# EAGLE design AVRKit_TFT (EAGLE 7.6.0)

## Sheet 1 of 3
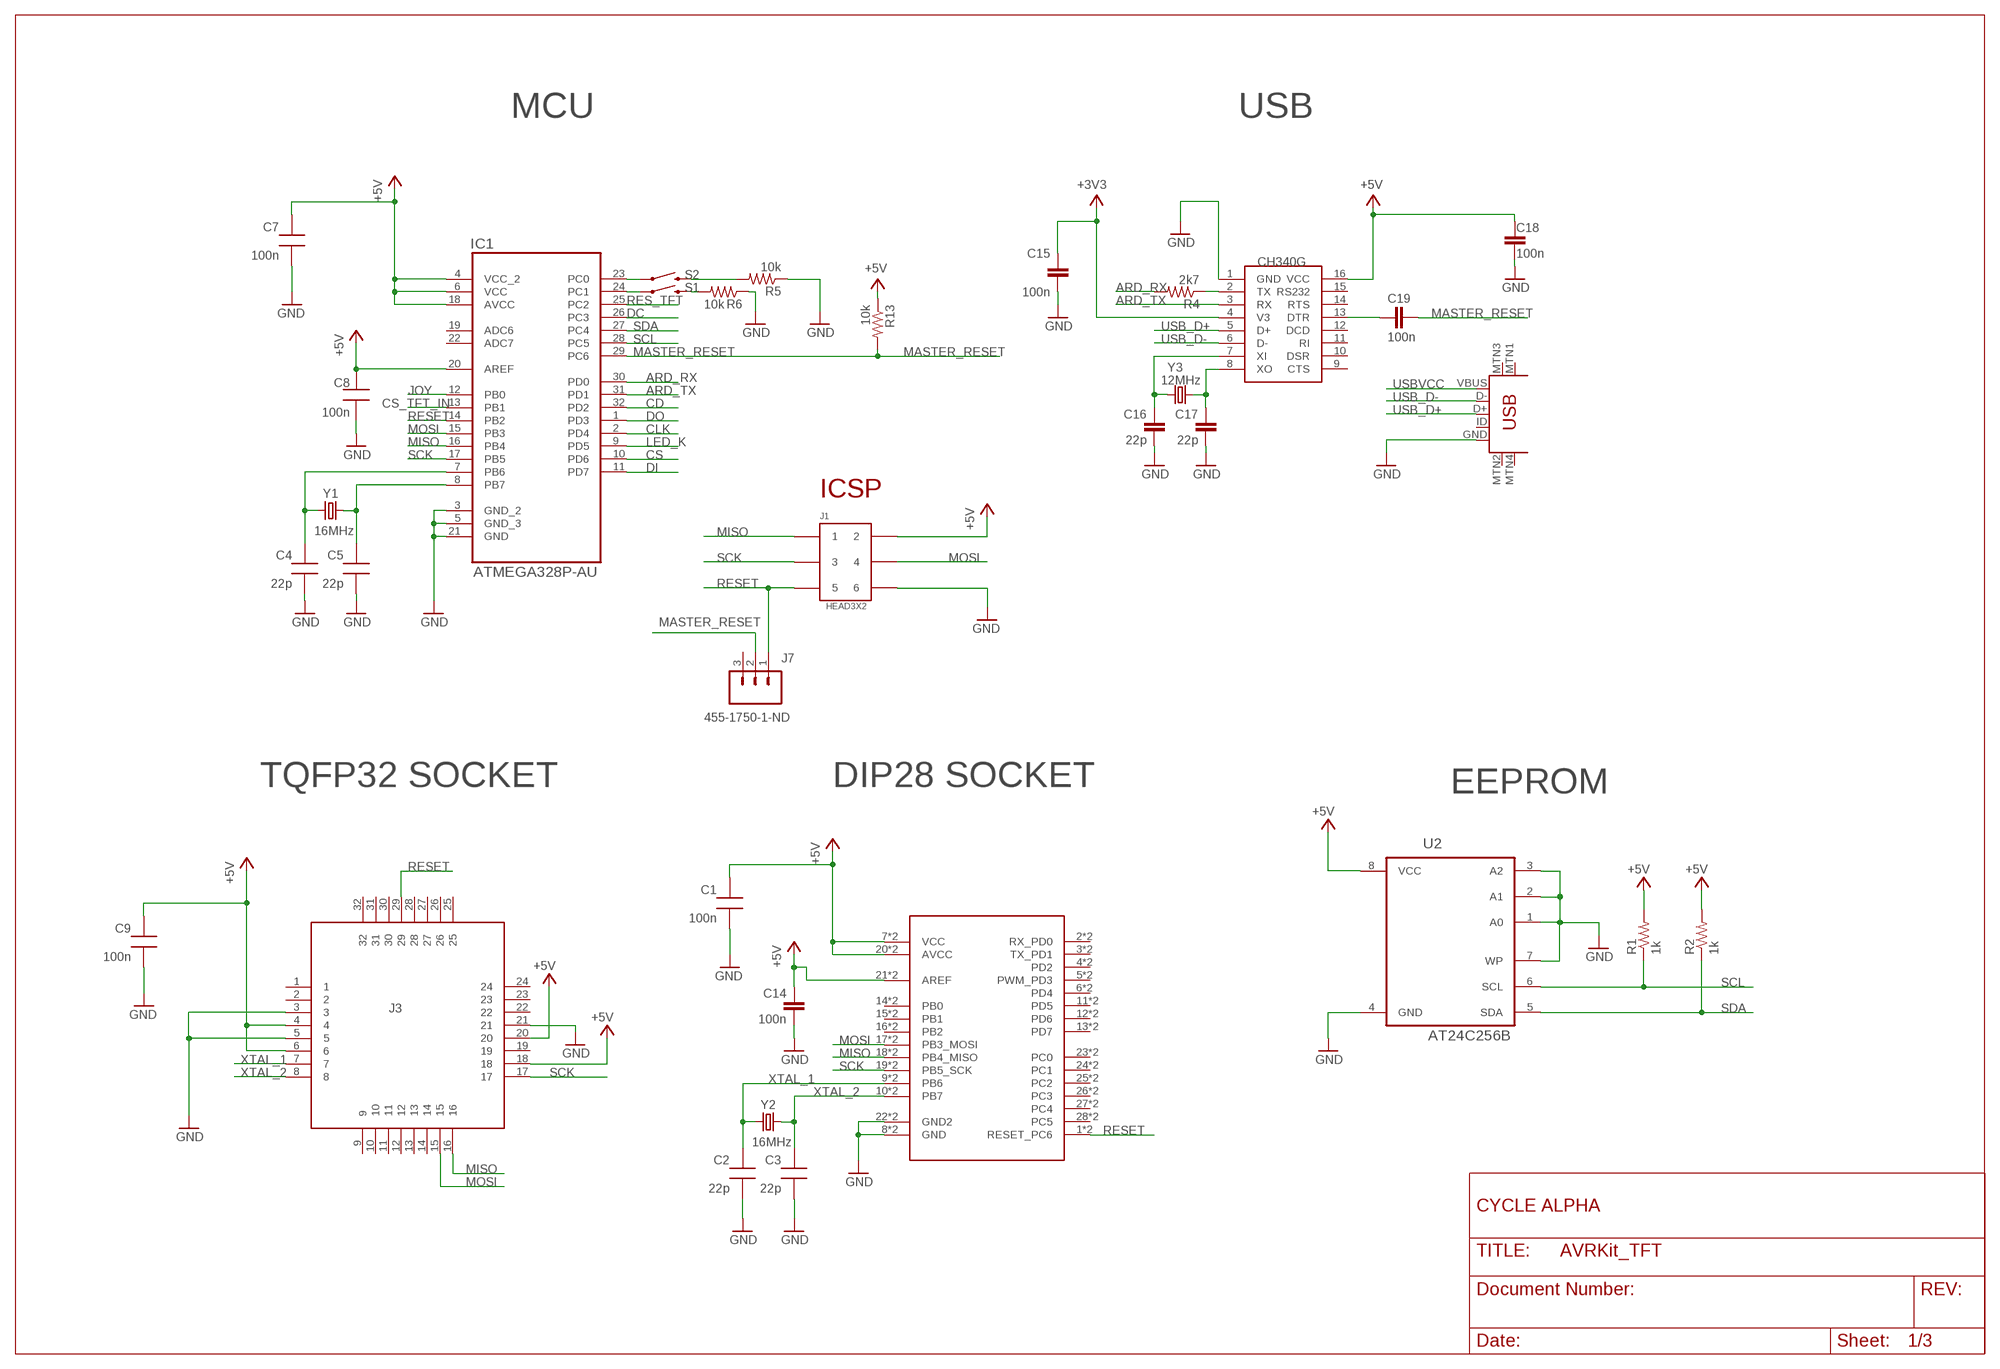
[diagram p0: schematic, sheet 1]

### Parts
C1  100n  CAP0805-NP  [CAP0805-NP]
C2  22p  CAP0805-NP  [CAP0805-NP]
C3  22p  CAP0805-NP  [CAP0805-NP]
C4  22p  CAP0805-NP  [CAP0805-NP]
C5  22p  CAP0805-NP  [CAP0805-NP]
C7  100n  CAP0805-NP  [CAP0805-NP]
C8  100n  CAP0805-NP  [CAP0805-NP]
C9  100n  CAP0805-NP  [CAP0805-NP]
C14  100n  22UF-6.3V-20%(0805)  [0805]
C15  100n  22UF-6.3V-20%(0805)  [0805]
C16  22p  22UF-6.3V-20%(0805)  [0805]
C17  22p  22UF-6.3V-20%(0805)  [0805]
C18  100n  22UF-6.3V-20%(0805)  [0805]
C19  100n  22UF-6.3V-20%(0805)  [0805]
IC1  ATMEGA328P-AU  [QFP80P900X900X120-32N]
J1  HEAD3X2  [HEAD3X2]
J3  TQFP32_ADAPTER  [TQFP32_ADAPTER]
J4  _ZIF28ADAPTER_2ROWS  [DIL28_2ROWS]
J5  USB-MINIB-5PIN  [USB-MINIB]
J7  455-1750-1-ND  CONN_03  [1X03]
R1  1k  R-US_R0805  [R0805@1]
R2  1k  R-US_R0805  [R0805@1]
R4  2k7  R-US_R0805  [R0805@1]
R5  10k  R-US_R0805  [R0805@1]
R6  10k  R-US_R0805  [R0805@1]
R13  10k  R-US_R0805  [R0805@1]
S1  SWITCH-MOMENTARY-2SMD-4  [TACTILE_SWITCH_TALL]
S2  SWITCH-MOMENTARY-2SMD-4  [TACTILE_SWITCH_TALL]
U1  0  CH340G  [SOIC16]
U2  AT24C256B  [SOIC8]
Y1  16MHz  CRYSTAL5X3  [CRYSTAL-SMD-5X3]
Y2  16MHz  CRYSTAL5X3  [CRYSTAL-SMD-5X3]
Y3  12MHz  CRYSTALCRYSTAL-SMD-5X3-16MHZ  [CRYSTAL-SMD-5X3]

### Nets
+3V3: C15.2 U1.4(V3) ; also sheet 2,3
+5V: C1.1 C7.1 C8.1 C9.1 C14.1 C18.2 IC1.4(VCC_2) IC1.6(VCC) IC1.18(AVCC) IC1.20(AREF) J1.2 J3.4 J3.6 J3.18 J3.20 J4.7(VCC) J4.20(AVCC) J4.21(AREF) J4.107(VCC) J4.120(AVCC) J4.121(AREF) R1.2 R2.2 R13.1 U1.16(VCC) U2.8(VCC) ; also sheet 2,3
ARD_RX: IC1.30(PD0) R4.2
ARD_TX: IC1.31(PD1) U1.3(RX)
CD: IC1.32(PD2) ; also sheet 2
CLK: IC1.2(PD4) ; also sheet 2
CS: IC1.10(PD6) ; also sheet 2
CS_TFT_IN: IC1.13(PB1) ; also sheet 3
DC: IC1.26(PC3) ; also sheet 3
DI: IC1.11(PD7) ; also sheet 2
DO: IC1.1(PD3) ; also sheet 2
GND: C1.2 C2.2 C3.2 C4.2 C5.2 C7.2 C8.2 C9.2 C14.2 C15.1 C16.2 C17.2 C18.1 IC1.3(GND_2) IC1.5(GND_3) IC1.21(GND) J1.6 J3.3 J3.5 J3.21 J4.8(GND) J4.22(GND2) J4.108(GND) J4.122(GND2) J5.GND R5.1 R6.1 U1.1(GND) U2.1(A0) U2.2(A1) U2.3(A2) U2.4(GND) U2.7(WP) ; also sheet 2,3
JOY: IC1.12(PB0) ; also sheet 3
LED_K: IC1.9(PD5) ; also sheet 3
MASTER_RESET: C19.1 IC1.29(PC6) J7.2 R13.2
MISO: IC1.16(PB4) J1.1 J3.16 J4.18(PB4_MISO) J4.118(PB4_MISO)
MOSI: IC1.15(PB3) J1.4 J3.15 J4.17(PB3_MOSI) J4.117(PB3_MOSI) ; also sheet 3
N$6: IC1.23(PC0) S2.A2
N$7: IC1.24(PC1) S1.A2
N$8: R5.2 S2.B2
N$9: R6.2 S1.B2
N$14: C19.2 U1.13(DTR)
N$17: R4.1 U1.2(TX)
OSC3: C4.1 IC1.7(PB6) Y1.3
OSC4: C5.1 IC1.8(PB7) Y1.1
RES_TFT: IC1.25(PC2) ; also sheet 3
RESET: IC1.14(PB2) J1.5 J3.29 J4.1(RESET_PC6) J4.101(RESET_PC6) J7.1
SCK: IC1.17(PB5) J1.3 J3.17 J4.19(PB5_SCK) J4.119(PB5_SCK) ; also sheet 3
SCL: IC1.28(PC5) R1.1 U2.6(SCL)
SDA: IC1.27(PC4) R2.1 U2.5(SDA)
USB_D+: J5.D+ U1.5(D+)
USB_D-: J5.D- U1.6(D-)
USBVCC: J5.VBUS ; also sheet 2
XI1: C16.1 U1.7(XI) Y3.1
XO1: C17.1 U1.8(XO) Y3.3
XTAL_1: C2.1 J3.7 J4.9(PB6) J4.109(PB6) Y2.3
XTAL_2: C3.1 J3.8 J4.10(PB7) J4.110(PB7) Y2.1
Unconnected: IC1.19(ADC6) IC1.22(ADC7) J3.1 J3.2 J3.9 J3.10 J3.11 J3.12 J3.13 J3.14 J3.19 J3.22 J3.23 J3.24 J3.25 J3.26 J3.27 J3.28 J3.30 J3.31 J3.32 J4.2(RX_PD0) J4.3(TX_PD1) J4.4(PD2) J4.5(PWM_PD3) J4.6(PD4) J4.11(PD5) J4.12(PD6) J4.13(PD7) J4.14(PB0) J4.15(PB1) J4.16(PB2) J4.23(PC0) J4.24(PC1) J4.25(PC2) J4.26(PC3) J4.27(PC4) J4.28(PC5) J4.102(RX_PD0) J4.103(TX_PD1) J4.104(PD2) J4.105(PWM_PD3) J4.106(PD4) J4.111(PD5) J4.112(PD6) J4.113(PD7) J4.114(PB0) J4.115(PB1) J4.116(PB2) J4.123(PC0) J4.124(PC1) J4.125(PC2) J4.126(PC3) J4.127(PC4) J4.128(PC5) J5.ID J5.MTN1(MTN2) J5.MTN2(MTN3) J5.MTN3(MTN1) J5.MTN4 J7.3 U1.9(CTS) U1.10(DSR) U1.11(RI) U1.12(DCD) U1.14(RTS) U1.15(RS232)

### Notes on the sheet
- MCU | USB
- ICSP
- TQFP32 SOCKET | DIP28 SOCKET | EEPROM
- CYCLE ALPHA

## Sheet 2 of 3
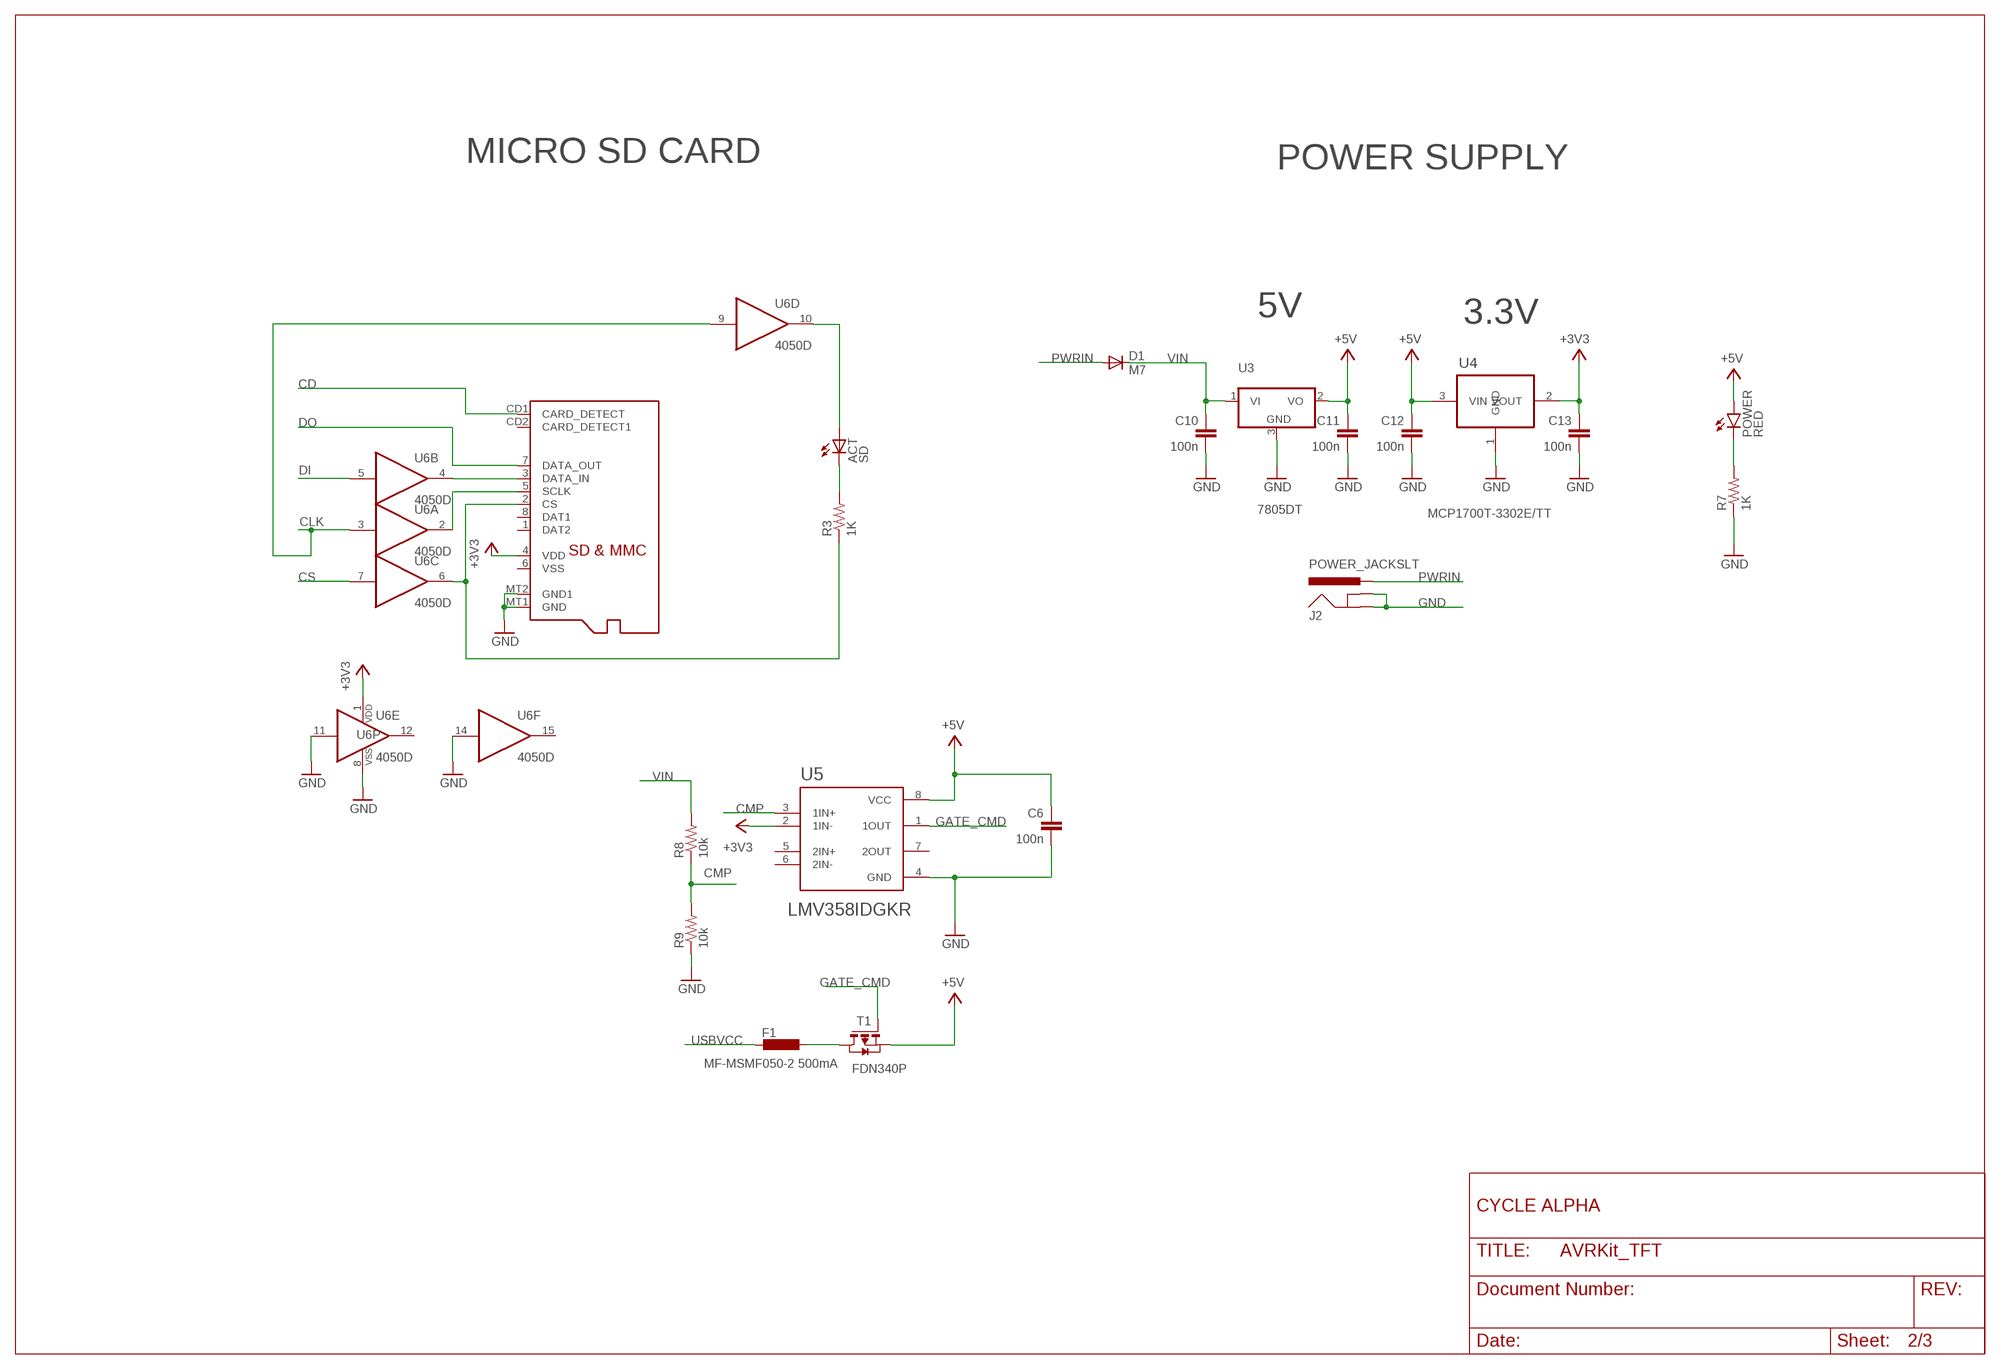
[diagram p1: schematic, sheet 2]

### Parts
ACT  SD  LEDCHIP-LED0805  [CHIP-LED0805]
C6  100n  22UF-6.3V-20%(0805)  [0805]
C10  100n  22UF-6.3V-20%(0805)  [0805]
C11  100n  22UF-6.3V-20%(0805)  [0805]
C12  100n  22UF-6.3V-20%(0805)  [0805]
C13  100n  22UF-6.3V-20%(0805)  [0805]
D1  M7  DIODE-SMB  [SMB]
F1  MF-MSMF050-2 500mA  L-EUL1812  [L1812]
J2  POWER_JACKSLT  [POWER_JACK_SLOT]
J6  MICROSD_FOOTPRINT_2  [MICROSD_FOOTPRINT_2]
POWER  RED  LED-RED1206  [LED-1206]
R3  1K  R-US_R0805  [R0805]
R7  1K  R-US_R0805  [R0805]
R8  10k  R-US_R0805  [R0805]
R9  10k  R-US_R0805  [R0805]
T1  FDN340P  PMOSSOT23  [SOT-23]
U3  7805DT  [TO252]
U4  MCP1700T-3302E/TT  [SOT95P237X112-3N]
U5  LMV358IDGKR  [SOP65P490X110-8N]
U6  4050D  [SO16]

### Nets
+3V3: C13.1 J6.4(VDD) U4.2(VOUT) U5.2(1IN-) U6.1(P:VDD) ; also sheet 1,3
+5V: C6.1 C11.1 C12.1 POWER.A T1.2(S) U3.2(VO) U4.3(VIN) U5.8(VCC) ; also sheet 1,3
CD: J6.CD1(CARD_DETECT) ; also sheet 1
CLK: U6.3(A:I) U6.9(D:I) ; also sheet 1
CMP: R8.1 R9.2 U5.3(1IN+)
CS: U6.7(C:I) ; also sheet 1
DI: U6.5(B:I) ; also sheet 1
DO: J6.7(DATA_OUT) ; also sheet 1
GATE_CMD: T1.3(G) U5.1(1OUT)
GND: C6.2 C10.2 C11.2 C12.2 C13.2 J2.GND@1(GNDBREAK) J2.GND@2(GND) J6.MT1(GND) J6.MT2(GND1) R7.1 R9.1 U3.3(GND) U4.1(GND) U5.4(GND) U6.8(P:VSS) U6.11(E:I) U6.14(F:I) ; also sheet 1,3
N$1: ACT.A U6.10(D:O)
N$2: J6.5(SCLK) U6.2(A:O)
N$3: J6.2(CS) R3.1 U6.6(C:O)
N$4: ACT.C R3.2
N$5: J6.3(DATA_IN) U6.4(B:O)
N$10: POWER.C R7.2
N$15: F1.1 T1.1(D)
PWRIN: D1.A J2.PWR
USBVCC: F1.2 ; also sheet 1
VIN: C10.1 D1.C R8.2 U3.1(VI)
Unconnected: J6.1(DAT2) J6.6(VSS) J6.8(DAT1) J6.CD2(CARD_DETECT1) U5.5(2IN+) U5.6(2IN-) U5.7(2OUT) U6.12(E:O) U6.15(F:O)

### Notes on the sheet
- MICRO SD CARD | POWER SUPPLY
- 5V | 3.3V
- CYCLE ALPHA

## Sheet 3 of 3
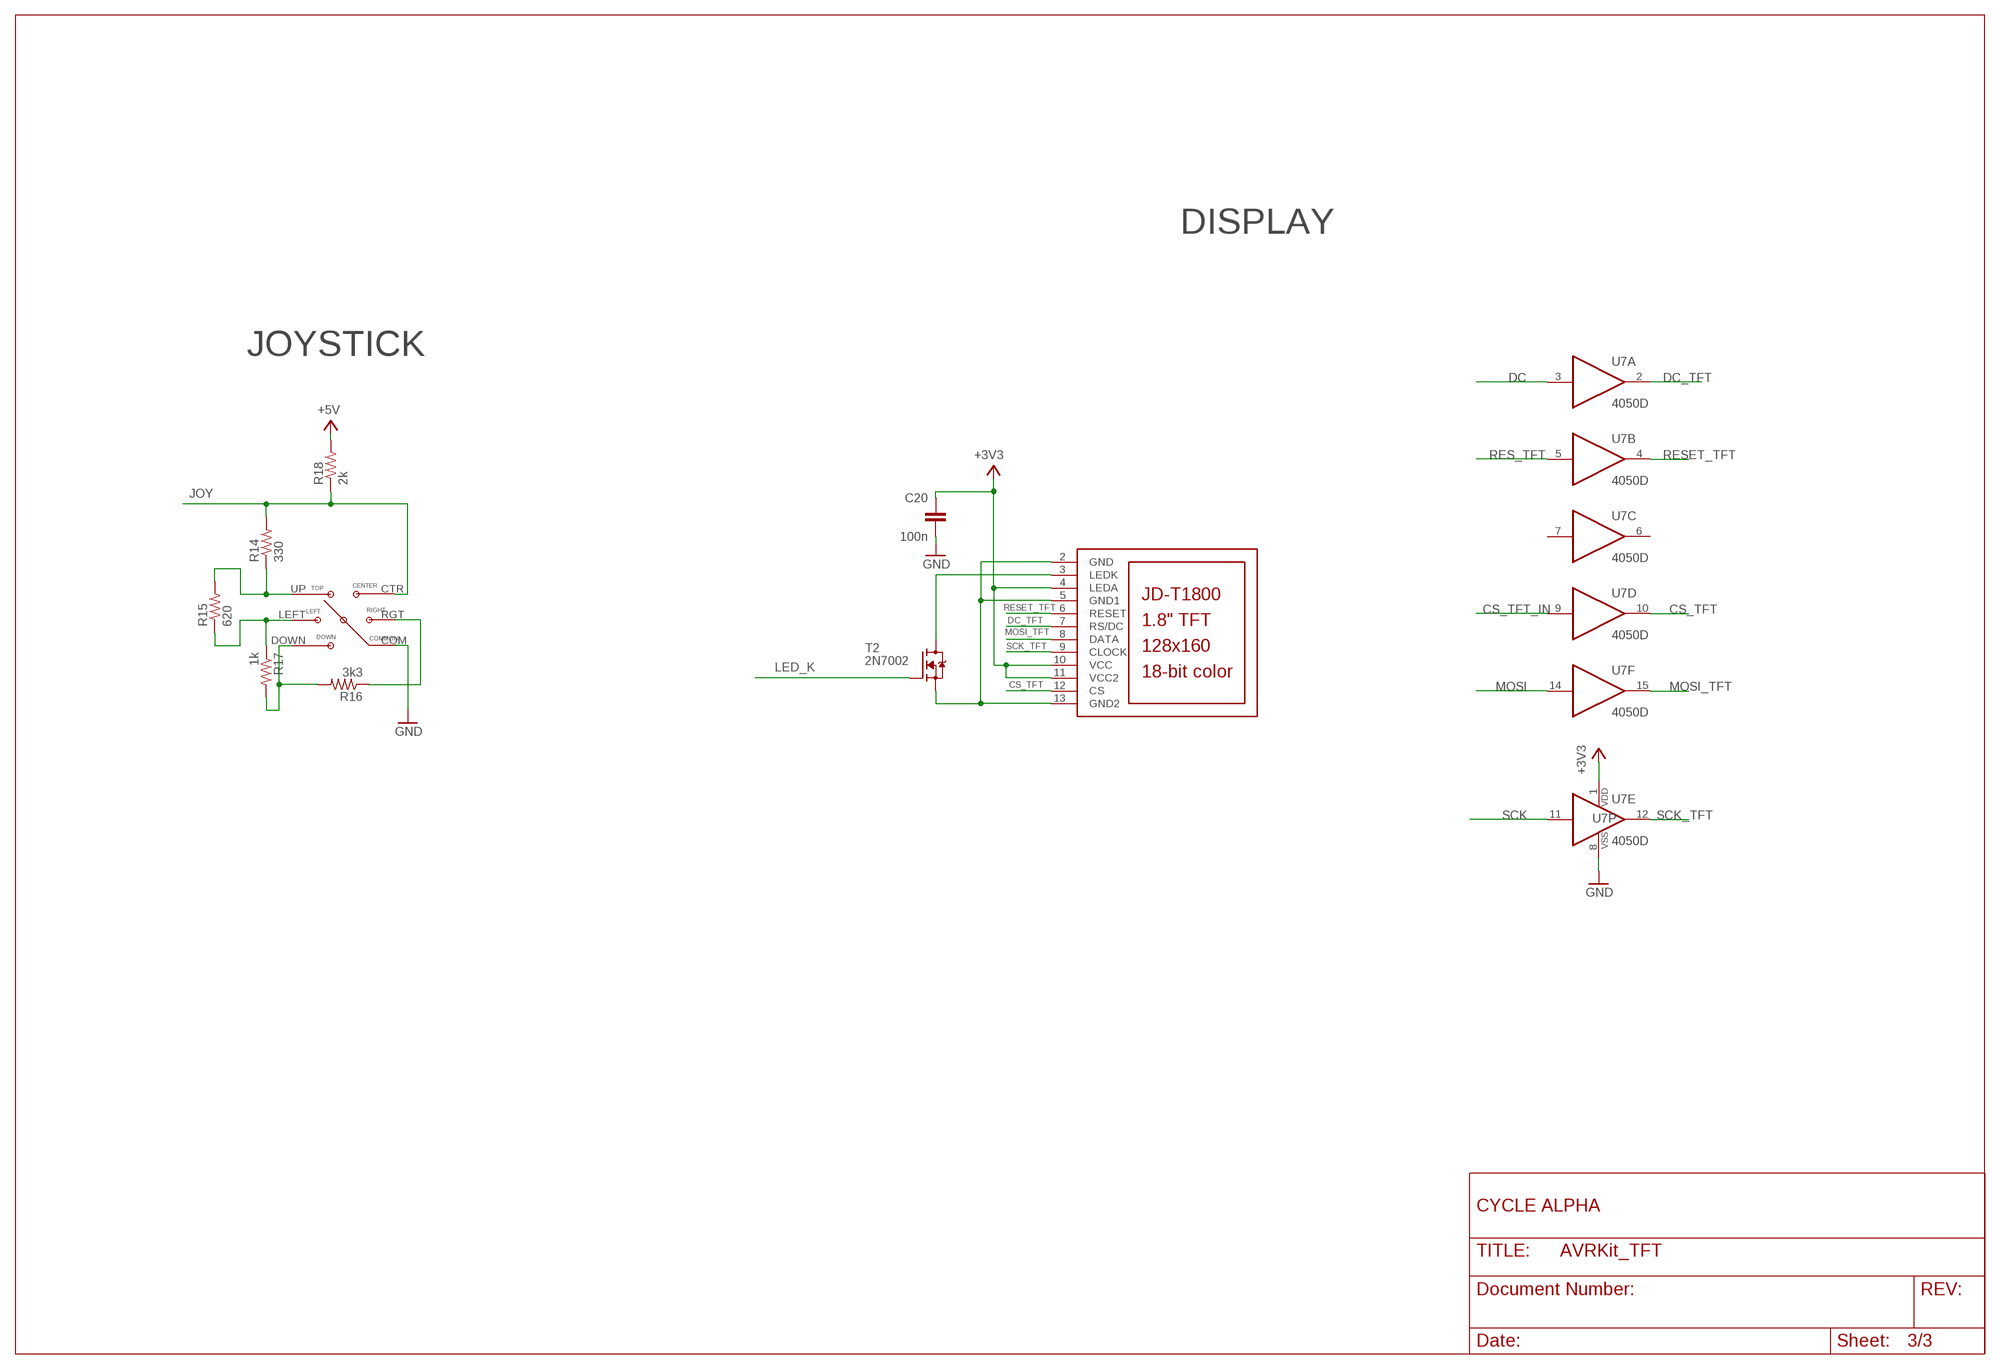
[diagram p2: schematic, sheet 3]

### Parts
C20  100n  22UF-6.3V-20%(0805)  [0805]
LCD1  JD-T1800  [JD-T1800]
R14  330  R-US_R0805  [R0805]
R15  620  R-US_R0805  [R0805]
R16  3k3  R-US_R0805  [R0805]
R17  1k  R-US_R0805  [R0805]
R18  2k  R-US_R0805  [R0805]
T2  2N7002  [SOT23]
U7  4050D  [SO16]
U$3  JOG-SWITCH-5-WAY-SMD  [JOG-SWITCH-10MM-SMD]

### Nets
+3V3: C20.2 LCD1.4(LEDA) LCD1.10(VCC) LCD1.11(VCC2) U7.1(P:VDD) ; also sheet 1,2
+5V: R18.2 ; also sheet 1,2
CS_TFT: LCD1.12(CS) U7.10(D:O)
CS_TFT_IN: U7.9(D:I) ; also sheet 1
DC: U7.3(A:I) ; also sheet 1
DC_TFT: LCD1.7(RS/DC) U7.2(A:O)
GND: C20.1 LCD1.2(GND) LCD1.5(GND1) LCD1.13(GND2) T2.2(S) U7.8(P:VSS) U$3.COM ; also sheet 1,2
JOY: R14.2 R18.1 U$3.CTR ; also sheet 1
LED_K: T2.1(G) ; also sheet 1
MOSI: U7.14(F:I) ; also sheet 1
MOSI_TFT: LCD1.8(DATA) U7.15(F:O)
N$18: LCD1.3(LEDK) T2.3(D)
N$20: R14.1 R15.2 U$3.UP
N$21: R15.1 R17.1 U$3.LEFT
N$22: R16.2 R17.2 U$3.DOWN
N$23: R16.1 U$3.RGT
RES_TFT: U7.5(B:I) ; also sheet 1
RESET_TFT: LCD1.6(RESET) U7.4(B:O)
SCK: U7.11(E:I) ; also sheet 1
SCK_TFT: LCD1.9(CLOCK) U7.12(E:O)
Unconnected: U7.6(C:O) U7.7(C:I)

### Notes on the sheet
- DISPLAY
- JOYSTICK
- CYCLE ALPHA

## Library data of the parts
ACT = adafruit:LED: LED OSRAM: - CHIPLED LG R971, LG N971, LY N971, LG Q971, LY Q971, LO R971, LY R971 LH N974, LH R974 LS Q976, LO Q976, LY Q976 LO Q996 - Hyper CHIPLED LW Q18S LB Q993, LB Q99A, LB R99A - SideLED LS A670, LO A670, LY A670, LG A670, LP A670 LB A673, LV A673, LT A673, LW A673 LH A674 LY A675 LS A676, LA A676, LO A676, LY A676, LW A676 LS A679, LY A679, LG A679 - Hyper Micro SIDELED® LS Y876, LA Y876, LO Y876, LY Y876 LT Y87S - SmartLED LW L88C, LW L88S LB L89C, LB L89S, LG L890 LS L89K, LO L89K, LY L89K LS L896, LA L896, LO L896, LY L896 - TOPLED LS T670, LO T670, LY T670, LG T670, LP T670 LSG T670, LSP T670, LSY T670, LOP T670, LYG T670 LG T671, LOG T671, LSG T671 LB T673, LV T673, LT T673, LW T673 LH T674 LS T676, LA T676, LO T676, LY T676, LB T676, LH T676, LSB T676, LW T676 LB T67C, LV T67C, LT T67C, LS T67K, LO T67K, LY T67K, LW E67C LS E67B, LA E67B, LO E67B, LY E67B, LB E67C, LV E67C, LT E67C LW T67C LS T679, LY T679, LG T679 LS T770, LO T770, LY T770, LG T770, LP T770 LB T773, LV T773, LT T773, LW T773 LH T774 LS E675, LA E675, LY E675, LS T675 LS T776, LA T776, LO T776, LY T776, LB T776 LHGB T686 LT T68C, LB T68C - Hyper Mini TOPLED® LB M676 - Mini TOPLED Santana® LG M470 LS M47K, LO M47K, LY M47K Source: http://www.osram.convergy.de/
C1-C5 C7-C9 = MySMD:CAP0805-NP
C6 C10-C20 = SparkFun-Capacitors:22UF-6.3V-20%(0805): CAP-08402 Ceramic; PROD_ID: CAP-08402; VALUE: 22uF
D1 = diode:DIODE-: DIODE
F1 = rcl:L-EU: INDUCTOR, European symbol
IC1 = Atmel_By_element14_Batch_1-00:ATMEGA328P-AU: 8-bit Microcontroller with In-System Programmable Flash; MPN: ATMEGA328P-AU; OC_FARNELL: 1715486; OC_NEWARK: 14R4631; PACKAGE: TQFP-32; SUPPLIER: Atmel
J1 = MyCON2:HEAD3X2
J2 = SparkFun-Connectors:POWER_JACK: Power Jack This is the standard 5.5mm barrel jack for power. The PTH is the most common, proven, reliable, footprint. The Slot footprint only works if the mill layer is transmitted to the PCB fab house so be warned. Mating wall wart : TOL-00298 (and others); PROD_ID: PRT-00119
J3 = TQFP32_ADAPTER:TQFP32_ADAPTER
J4 = DIP28_ADAPTER_ATMEGA328P-PU:_ZIF28ADAPTER_2ROWS
J5 = SparkFun:USB-MINIB: Mini-USB "B" connector with 5th pin broken out. Created new symbol breaking out 5th "ID" pin in mini/micro USB connector spec. See: http://en.wikipedia.org/wiki/Mini_usb#Cables. Uses same footprint as 4-pin symbol. Also added pins to connect to mounting / shield pads if required (probably not generally needed as signals aren't shielded once they leave the connector).
J6 = adafruit:MICROSD_FOOTPRINT_2: Micro-SD / Transflash card holder with SPI pinout For the 3M # 2908-05WB-MG and/or 4UCON #19656 push-push type
J7 = SparkFun-Connectors:CONN_03: Multi connection point. Often used as Generic Header-pin footprint for 0.1 inch spaced/style header connections On any of the 0.1 inch spaced packages, you can populate with these: Break Away Headers - Straight <https://www.sparkfun.com/products/116> (PRT-00116) Break Away Male Headers - Right Angle <https://www.sparkfun.com/products/553> (PRT-00553) Female Headers <https://www.sparkfun.com/products/115> (PRT-00115) Break Away Headers - Machine Pin <https://www.sparkfun.com/products/117> (PRT-00117) Break Away Female Headers - Swiss Machine Pin <https://www.sparkfun.com/products/743> (PRT-00743) Stackable Header - 3 Pin (Female, 0.1") <https://www.sparkfun.com/products/13875> (PRT-13875) For SCREWTERMINALS and SPRING TERMINALS visit here: Screw Terimnals on SparkFun.com <https://www.sparkfun.com/search/results?term=Screw+Terminals> (5mm/3.5mm/2.54mm spacing) This device is also useful as a general connection point to wire up your design to another part of your project. Our various solder wires solder well into these plated through hole pads. Hook-Up Wire - Assortment (Stranded, 22 AWG) <https://www.sparkfun.com/products/11375> (PRT-11375) Hook-Up Wire - Assortment (Solid Core, 22 AWG) <https://www.sparkfun.com/products/11367> (PRT-11367) View the entire wire category on our website here <https://www.sparkfun.com/categories/141> Special notes: Molex polarized connector foot print use with SKU : PRT-08232 with associated crimp pins and housings.; PROD_ID: XXX-00000
LCD1 = adafruit:JD-T1800
POWER = SparkFun-LED:LED-RED: Assorted Red LEDs LilyPad 1206- DIO-09912 1206- DIO-00809 0603- DIO-00819 "SMART" means more efficient and expensive; PROD_ID: DIO-09912
R1 R2 R4-R6 R13 = resistor:R-US_: RESISTOR, American symbol
R3 R7-R9 R14-R18 = adafruit:R-US_: RESISTOR, American symbol
S1 S2 = SparkFun-Electromechanical:SWITCH-MOMENTARY-2: Various NO switches- pushbuttons, reed, etc; PROD_ID: SWCH-11966
T1 = zetex:PMOSSOT23: MOS FET
T2 = 00HT:2N7002: 2N7002 N Channel Mosfet in SOT23
U1 = ch340g:CH340G
U2 = AT24C256B (EEPROM) _duzi padovi:AT24C256B: Switch Mode Regulator; AVAILABILITY: Good; DESCRIPTION: IC REG MULT CONFIG ISO ADJ 8SOIC; MF: Texas Instruments; MP: LM5002MA; PACKAGE: SOIC-8 Texas Instruments; PRICE: 2.90 USD
U3 = linear:78*: Positive VOLTAGE REGULATOR Source: http://cache.national.com/ds/LM/LM78L05.pdf http://www.fairchildsemi.com/ds/LM/LM7805.pdf
U4 = MCP1700T-3302E_TT:MCP1700T-3302E/TT: Low Quiescent Current LDO
U5 = LMV358IDGKR:LMV358IDGKR: Dual Low-Voltage Rail-to-Rail Output Operational Amplifier 8-VSSOP -40 to 125; AVAILABILITY: Good; DESCRIPTION: IC OPAMP GP 1MHZ RRO 8VSSOP; MF: Texas Instruments; MP: LMV358IDGKR; PACKAGE: MSOP-8 Texas Instruments; PRICE: 0.40 USD
U6 U7 = 40xx:4050: Hex non-inverting BUFFER
U$3 = 00HT:JOG-SWITCH-5-WAY-SMD
Y1 Y2 = SparkFun:CRYSTAL: Crystals Various standard crystals. Proven footprints. Spark Fun Electronics SKU : COM-00534
Y3 = SparkFun-FreqCtrl:CRYSTAL: Various standard crystals. Proven footprints.; PROD_ID: XTAL-08218

## Net classes
1 GND: width 0.508 mm

## Board
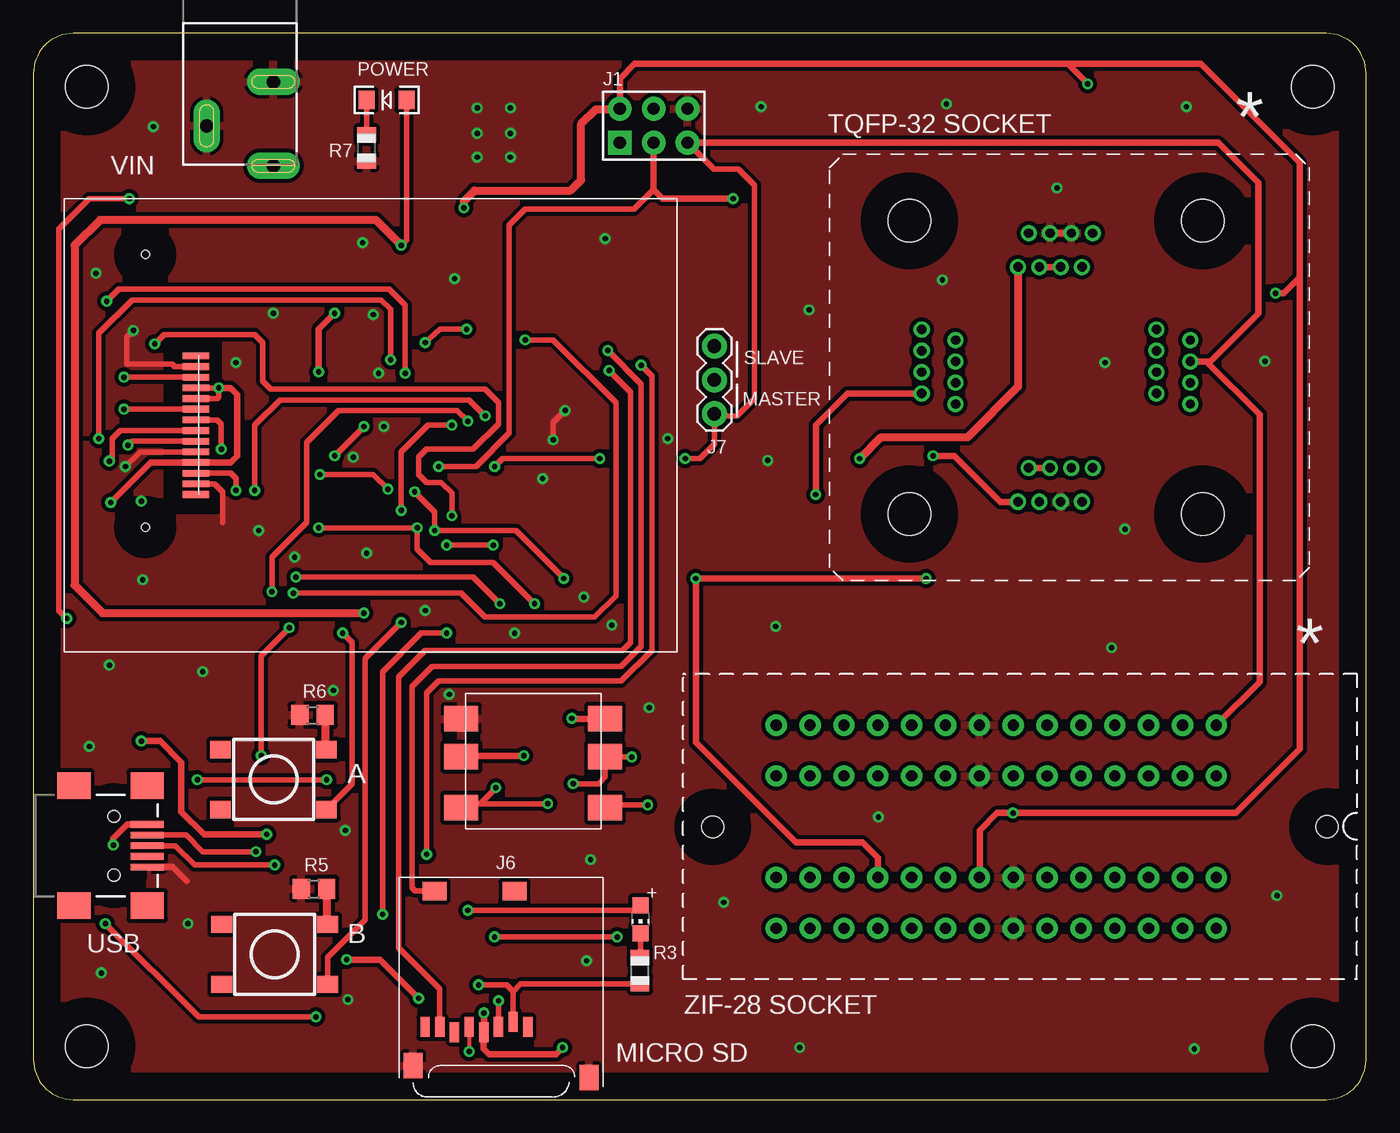
[diagram p3: board, top side]
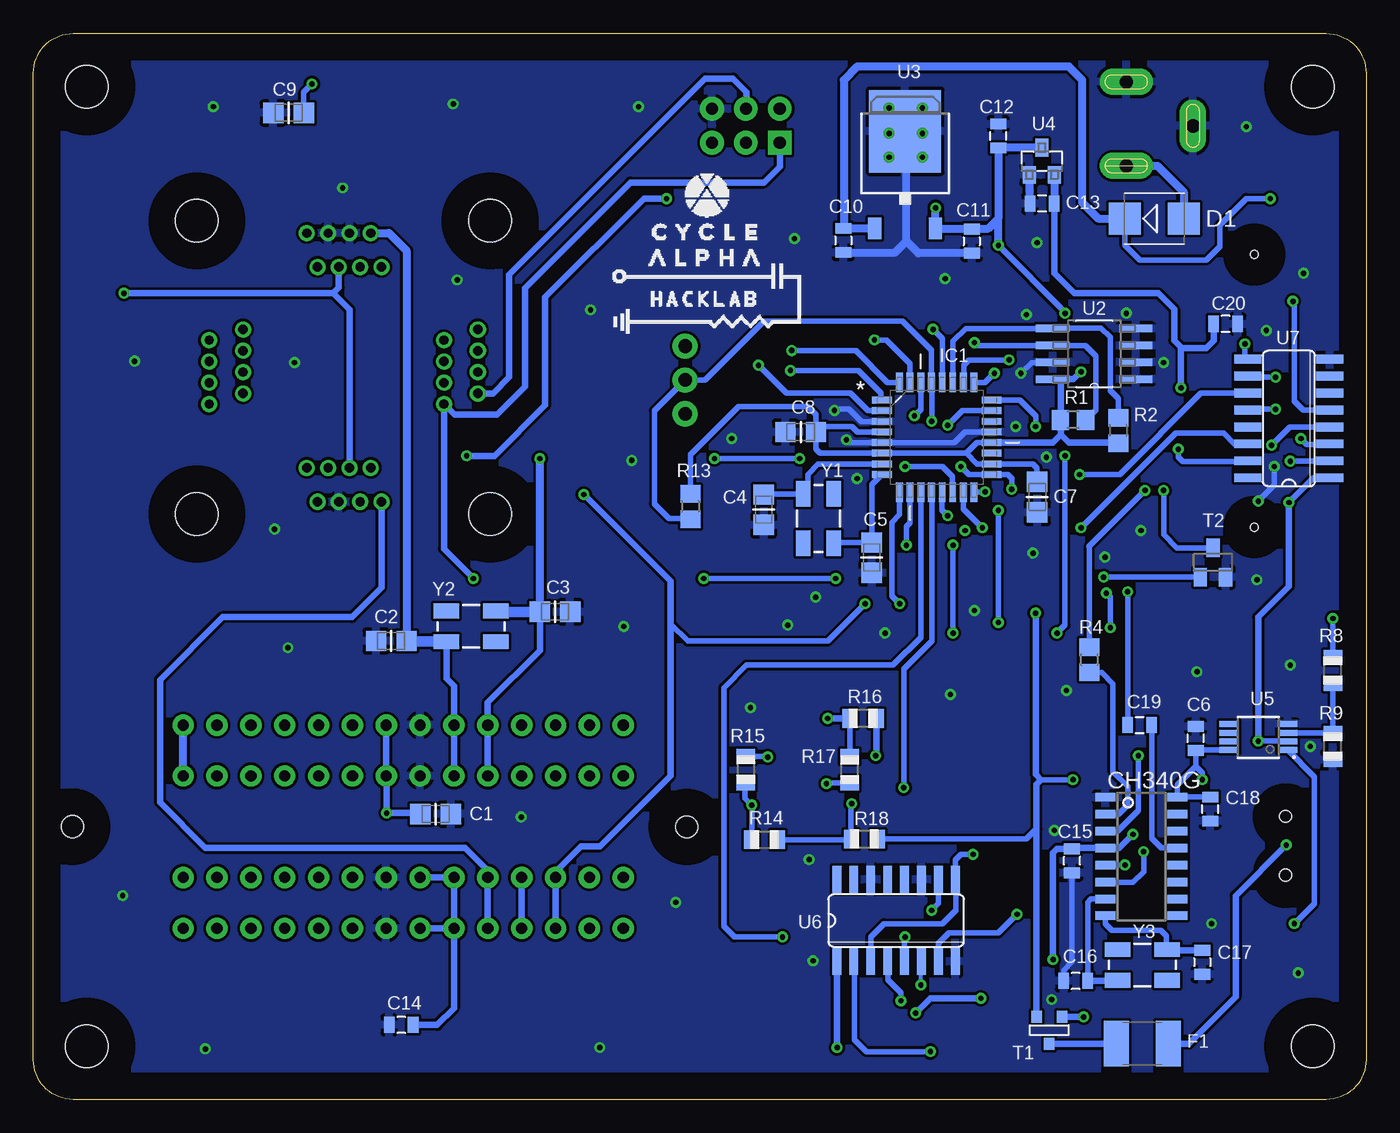
[diagram p4: board, bottom side, seen from below]

Size 100 x 80 mm. Coordinates in mm from the lower left corner, seen from the top.
Outline: 3,0 97,0 arc90 100,3 100,77 arc90 97,80 3,80 arc90 0,77 0,3 arc90 3,0
Copper layers (1*16): Top 0.035mm / dielectric 1.5mm / Bottom 0.035mm
Design rules "default *": minimum track width 10mil, minimum drill 24mil, track to track 8mil, track to pad 8mil, pad to pad 8mil, via to via 8mil, smd to smd 8mil, copper to edge 80mil, drill to drill 8mil, minimum pad ring 10mil, minimum via ring 8mil, stop-mask expansion 4mil, vias tented up to drill 50mil, thermal gap 10mil
Holes 3.2 mm at 4,76 4,4 96,4 96,76

### Footprints (pad centres in the part's own frame; a part is rotated, then mirrored left to right if it is on the bottom)
CHIP-LED0805 = smd 1.2 x 1.2: A 0,-1.05; C 0,1.05
CAP0805-NP = smd 1.524 x 1.524: 1 0,0; 2 2.286,0
0805 = smd 0.8 x 1.2: 1 -0.9,0; 2 0.9,0
SMB = smd 2.4 x 2.4: A 2.2,0; C -2.2,0
L1812 = smd 1.9 x 3.4: 1 -1.95,0; 2 1.95,0
QFP80P900X900X120-32N = smd 1.473 x 0.508: 1 -4.115,2.794; 2 -4.115,2.007; 3 -4.115,1.194; 4 -4.115,0.406; 5 -4.115,-0.406; 6 -4.115,-1.194; 7 -4.115,-2.007; 8 -4.115,-2.794; 17 4.115,-2.794; 18 4.115,-2.007; 19 4.115,-1.194; 20 4.115,-0.406; 21 4.115,0.406; 22 4.115,1.194; 23 4.115,2.007; 24 4.115,2.794 | smd 0.508 x 1.473: 9 -2.794,-4.115; 10 -2.007,-4.115; 11 -1.194,-4.115; 12 -0.406,-4.115; 13 0.406,-4.115; 14 1.194,-4.115; 15 2.007,-4.115; 16 2.794,-4.115; 25 2.794,4.115; 26 2.007,4.115; 27 1.194,4.115; 28 0.406,4.115; 29 -0.406,4.115; 30 -1.194,4.115; 31 -2.007,4.115; 32 -2.794,4.115
HEAD3X2 = drill 0.914 pad 1.778 square: 1 0,0 | drill 0.914 pad 1.778: 2 0,2.54; 3 2.54,0; 4 2.54,2.54; 5 5.08,0; 6 5.08,2.54
POWER_JACK_SLOT = drill 1 pad 2 long: GND@1 2.58,7.5; GND@2 7.58,10.8; PWR 2.58,13.8
TQFP32_ADAPTER = drill 0.7: 1 -2.75,-10.08; 2 -1.95,-7.54; 3 -1.15,-10.08; 4 -0.35,-7.54; 5 0.45,-10.08; 6 1.25,-7.54; 7 2.05,-10.08; 8 2.85,-7.54; 9 10.08,-2.85; 10 7.54,-2.05; 11 10.08,-1.25; 12 7.54,-0.45; 13 10.08,0.35; 14 7.54,1.15; 15 10.08,1.95; 16 7.54,2.75; 17 2.85,10.08; 18 2.05,7.54; 19 1.25,10.08; 20 0.45,7.54; 21 -0.35,10.08; 22 -1.15,7.54; 23 -1.95,10.08; 24 -2.75,7.54; 25 -10.08,2.75; 26 -7.54,1.95; 27 -10.08,1.15; 28 -7.54,0.35; 29 -10.08,-0.45; 30 -7.54,-1.25; 31 -10.08,-2.05; 32 -7.54,-2.85 | hole 3.2: 11,11; -11,11; -11,-11; 11,-11
DIL28_2ROWS = drill 0.838 pad 1.6: 1 10.54,3.81; 2 13.08,3.81; 3 15.62,3.81; 4 18.16,3.81; 5 20.7,3.81; 6 23.24,3.81; 7 25.78,3.81; 8 28.32,3.81; 9 30.86,3.81; 10 33.4,3.81; 11 35.94,3.81; 12 38.48,3.81; 13 41.02,3.81; 14 43.56,3.81; 15 43.56,19.05; 16 41.02,19.05; 17 38.48,19.05; 18 35.94,19.05; 19 33.4,19.05; 20 30.86,19.05; 21 28.32,19.05; 22 25.78,19.05; 23 23.24,19.05; 24 20.7,19.05; 25 18.16,19.05; 26 15.62,19.05; 27 13.08,19.05; 28 10.54,19.05; 101 10.54,7.62; 102 13.08,7.62; 103 15.62,7.62; 104 18.16,7.62; 105 20.7,7.62; 106 23.24,7.62; 107 25.78,7.62; 108 28.32,7.62; 109 30.86,7.62; 110 33.4,7.62; 111 35.94,7.62; 112 38.48,7.62; 113 41.02,7.62; 114 43.56,7.62; 115 43.56,15.24; 116 41.02,15.24; 117 38.48,15.24; 118 35.94,15.24; 119 33.4,15.24; 120 30.86,15.24; 121 28.32,15.24; 122 25.78,15.24; 123 23.24,15.24; 124 20.7,15.24; 125 18.16,15.24; 126 15.62,15.24; 127 13.08,15.24; 128 10.54,15.24 | hole 1.65: 2.23,11.42; 48.32,11.44
USB-MINIB = smd 2.5 x 0.5: D+ 2.5,0; D- 2.5,0.8; GND 2.5,-1.6; ID 2.5,-0.8; VBUS 2.5,1.6 | smd 2.5 x 2: MTN1 -3,4.5; MTN2 2.5,4.5; MTN3 -3,-4.5; MTN4 2.5,-4.5 | hole 0.9: 0,2.2; 0,-2.2
MICROSD_FOOTPRINT_2 = smd 0.7 x 1.5: 1 9,-10.64; 2 7.9,-10.24; 3 6.8,-10.64; 4 5.7,-11.04; 5 4.6,-10.64; 6 3.5,-11.04; 7 2.4,-10.64; 8 1.3,-10.64 | smd 1.8 x 1.4: CD1 2,-0.44; CD2 8,-0.44 | smd 1.4 x 1.9: MT1 0.4,-13.54; MT2 13.6,-14.44
1X03 = drill 1.016 pad 1.88: 1 0,0; 2 2.54,0; 3 5.08,0
JD-T1800 = smd 0.5 x 2: 1 5.2,-13.1; 2 4.4,-13.1; 3 3.6,-13.1; 4 2.8,-13.1; 5 2,-13.1; 6 1.2,-13.1; 7 0.4,-13.1; 8 -0.4,-13.1; 9 -1.2,-13.1; 10 -2,-13.1; 11 -2.8,-13.1; 12 -3.6,-13.1; 13 -4.4,-13.1; 14 -5.2,-13.1 | hole 0.6: -12.8,-16.9; 7.65,-16.9
LED-1206 = smd 1.2 x 1.4: A -1.5,0; C 1.5,0
R0805@1 = smd 1.3 x 1.5: 1 -0.95,0; 2 0.95,0
R0805 = smd 1.1 x 1.4: 1 -1,0; 2 1,0
TACTILE_SWITCH_TALL = smd 1.55 x 1.3: A1 -3.975,-2.25; A2 3.975,-2.25; B1 -3.975,2.25; B2 3.975,2.25
SOT-23 = smd 0.787 x 0.889: 1 0.025,-1.016; 2 -0.94,1.016; 3 0.991,1.016
SOT23 = smd 1 x 1.4: 1 -0.95,-1.1; 2 0.95,-1.1; 3 0,1.1
SOIC16 = smd 0.635 x 1.524: 1 -4.445,-2.695; 2 -3.175,-2.695; 3 -1.905,-2.695; 4 -0.635,-2.695; 5 0.635,-2.695; 6 1.905,-2.695; 7 3.175,-2.695; 8 4.445,-2.695; 9 4.445,2.695; 10 3.175,2.695; 11 1.905,2.695; 12 0.635,2.695; 13 -0.635,2.695; 14 -1.905,2.695; 15 -3.175,2.695; 16 -4.445,2.695
SOIC8 = smd 2.5 x 0.56: 1 -3.114,1.905; 2 -3.114,0.635; 3 -3.114,-0.635; 4 -3.114,-1.905; 5 3.114,-1.905; 6 3.114,-0.635; 7 3.114,0.635; 8 3.114,1.905
TO252 = smd 1 x 1.6: 1 -2.28,-4.8; 2 2.28,-4.8 | smd 5.4 x 6.2: 3 0,2.5
SOT95P237X112-3N = smd 0.991 x 1.321: 1 -0.94,-1.016; 2 0.94,-1.016; 3 0,1.016
SOP65P490X110-8N = smd 1.45 x 0.45: 1 -2.2,0.975; 2 -2.2,0.325; 3 -2.2,-0.325; 4 -2.2,-0.975; 5 2.2,-0.975; 6 2.2,-0.325; 7 2.2,0.325; 8 2.2,0.975
SO16 = smd 0.66 x 2.032: 1 -4.445,-3.073; 2 -3.175,-3.073; 3 -1.905,-3.073; 4 -0.635,-3.073; 5 0.635,-3.073; 6 1.905,-3.073; 7 3.175,-3.073; 8 4.445,-3.073; 9 4.445,3.073; 10 3.175,3.073; 11 1.905,3.073; 12 0.635,3.073; 13 -0.635,3.073; 14 -1.905,3.073; 15 -3.175,3.073; 16 -4.445,3.073
JOG-SWITCH-10MM-SMD = smd 2.54 x 1.93: COM 5.397,-3.175; CTR 5.397,3.493; DOWN -5.397,-3.175; LEFT -5.397,-0.318; RGT 5.397,-0.318; UP -5.397,3.493
CRYSTAL-SMD-5X3 = smd 1.9 x 1.1: 1 -1.85,-1.15; 2 1.85,-1.15; 3 1.85,1.15; 4 -1.85,1.15

### Placement (x,y rotation side)
ACT  45.55,13.51 180 top
C1  70.96,21.42 0 bottom
C2  72,34.4 180 bottom
C3  62,36.6 0 bottom
C4  45.2,45.4 270 bottom
C5  37.1,41.8 270 bottom
C6  12.8,27.1 90 bottom
C7  24.68,46.34 270 bottom
C8  41.28,50.08 180 bottom
C9  79.71,74.03 180 bottom
C10  39.23,64.45 270 bottom
C11  29.6,64.4 270 bottom
C12  27.6,72.3 90 bottom
C13  24.32,67.23 180 bottom
C14  72.4,5.6 180 bottom
C15  22.07,17.91 90 bottom
C16  21.8,8.9 180 bottom
C17  12.3,10.3 270 bottom
C18  11.7,21.8 90 bottom
C19  17,28.1 0 bottom
C20  10.55,58.2 180 bottom
D1  15.9,66.1 0 bottom
F1  16.8,4.2 0 bottom
IC1  32.22,49.69 0 bottom
J1  44,71.8 0 top
J2  20.58,83.86 180 top
J3  76.73,54.93 180 top
J4  99.3,31.9 180 top
J5  6.04,19.05 0 top
J6  28.09,16.09 0 top
J7  51.1,51.45 90 top
LCD1  25.3,50.6 270 top
POWER  26.5,75 180 top
R1  22,51 180 bottom
R2  18.6,50.2 270 bottom
R3  45.51,9.67 90 top
R4  20.76,32.99 90 bottom
R5  21.06,15.81 0 top
R6  20.94,28.84 0 top
R7  25,71.4 90 top
R8  2.5,32.2 90 bottom
R9  2.5,26.5 90 bottom
R13  50.7,44.5 270 bottom
R14  45.15,19.5 0 bottom
R15  46.55,24.75 270 bottom
R16  37.75,28.6 180 bottom
R17  38.75,24.75 90 bottom
R18  37.65,19.55 0 bottom
S1  18.02,24.01 0 top
S2  18.1,10.9 0 top
T1  23.8,5.2 0 bottom
T2  11.5,40.3 0 bottom
U1  16.87,18.23 270 bottom
U2  20.4,55.95 180 bottom
U3  34.6,70.15 0 bottom
U4  24.33,70.4 0 bottom
U5  8.1,27.2 180 bottom
U6  35.27,13.43 0 bottom
U7  5.8,51.1 90 bottom
U$3  37.5,25.4 180 top
U$4  [LOGO_CYCLE_ALPHA_HACKLAB_14X12_MM]  56.5,57.5 0 bottom
Y1  41.09,43.59 90 bottom
Y2  67.16,35.51 180 bottom
Y3  16.79,10.09 0 bottom

### Tracks (layer width: path | path; a pad name or v marks a point on that pad's centre or on a via)
+3V3  (via drill 0.4, 0.4 pad 0.6)
  Top 0.4: LCD1.11 v13.9,53.4 13.9,52.7 13.8,52.6 LCD1.10 | J6.4
  Top 0.5: J6.4 33.79,3.81 34.2,3.4 39.2,3.4 v39.7,3.9 | v17.5,19.9 12.8,19.9 11.1,21.6 11.1,25.3 9.5,26.9 v8.1,26.9 | v23.5,10.5 26,10.5 v28.9,7.6 | v33.8,6.5 J6.4 | v13.9,53.4 14.8,53.4 15.3,52.9 15.3,48.3 14.8,47.8 LCD1.4 8.8,47.8 v5.8,44.8
  Bottom 0.3: 39.7,10.34 U6.1
  Bottom 0.4: 22.02,18.86 C15.2 | v8.1,26.9 5.92,26.9 U5.2 | 13.85,56.4 13.9,56.45 | U7.1 2.78,46.6
  Bottom 0.5: v39.7,3.9 39.7,10.34 | v13.9,53.4 13.9,56.45 14.4,56.95 14.4,59.3 15.6,60.5 21.9,60.5 23.39,61.99 23.39,67.16 | 22.02,18.86 U1.4 18.54,18.86 v17.5,19.9 | C15.2 23.19,18.81 23.5,18.5 v23.5,10.5 | v28.9,7.6 32.7,7.6 v33.8,6.5 | v8.1,26.9 8.1,36.2 5.8,38.5 v5.8,44.8 4,46.6 2.78,46.6 | C20.2 11.45,56.95 12,56.4 13.85,56.4
  Bottom 0.6: U4.2 23.39,67.16 C13.1
+5V  (via drill 0.4, 0.4 pad 0.6, 0.4 pad 0.8)
  Top 0.4: v22,24 v12.3,24 | POWER.A 28,64.5 v27.6,64.1
  Top 0.406: v79.1,76.2 77.6,77.7
  Top 0.5: J3.6 J3.4 | J3.20 J3.18 | J1.2 44,76.6 45.1,77.7 77.6,77.7 87.6,77.7 95,70.3 95,61.7 | v93.2,60.5 93.8,60.5 95,61.7 | 95,61.7 95,26.3 90.2,21.5 v73.5,21.5 72.3,21.5 71,20.2 71,16.68 J4.121 | v21.4,54.6 21.4,57.8 v22.6,59
  Top 0.6: v32.3,66.9 32.3,67.4 33.1,68.2 40.3,68.2 41.1,69 41.1,73.2 42.2,74.3 43.96,74.3 J1.2 | v27.6,64.1 25.7,66 5,66 3.1,64.1 3.1,38.6 5.2,36.5 v24.8,36.5
  Bottom 0.4: 22.9,50.95 R1.2 22.86,51.29 22.9,51.29 | 36.35,50.08 IC1.4 | IC1.6 30,48.5 | 28.12,47.7 IC1.18 | 28.12,47.7 25,47.7 24.7,47.4 24.7,46.36 C7.1 | 37.38,50.08 38.18,50.08 38.6,50.5 40.86,50.5 C8.1 41.28,51.38 41.9,52 47.1,52 50.7,48.4 R13.1 | 22.9,54.05 U2.8 | C18.2 14.15,22.7 U1.16 14.18,23.62 12.8,25 | U5.8 12.78,26.23 C6.1 12.8,25 | R18.2 25.49,19.55 24.74,20.3 | v12.3,24 12.3,24.5 12.8,25 | v22,24 24.4,24 24.74,23.66 | 18.65,49.3 R2.2 | v22.6,59 22.6,59.1 | 28.12,47.7 29.2,47.7 30,48.5 | IC1.20 29.21,49.28 30,48.5
  Bottom 0.406: 36.35,50.08 37.38,50.08 | IC1.6 41,48.5 41.3,48.8 41.3,50.06 C8.1 | C9.1 79.71,75.59 v79.1,76.2
  Bottom 0.5: 18.65,49.3 22.3,49.3 22.9,49.9 | 22.9,49.9 22.9,50.95 | IC1.20 23.52,49.28 22.9,49.9 | 22.9,51.29 22.9,54.05 | T1.2 24.74,20.3 24.74,23.66 | C14.1 69.7,5.6 68.44,6.86 J4.20 | 73.5,24.26 v73.5,21.5 71.04,21.5 | 24.4,24 24.8,24.4 v24.8,36.5 | 22.6,59.1 v27.6,64.1 | U2.8 21.95,54.05 v21.4,54.6 | v93.2,60.5 77.5,60.5 | 77.5,60.5 77.08,60.92 J3.4 | 77.5,60.5 76.28,59.28 J3.20 | J4.20 J4.120 J4.121 | J4.20 J4.21 | J4.7 J4.107
  Bottom 0.6: 29.65,65.35 U3.2 32.32,66.88 v32.3,66.9 | 29.65,65.35 C11.1 | 29.65,65.35 28.35,65.35 27.6,66.1 | 24.55,71.4 U4.3 | 24.3,71.35 U4.3 | v27.6,64.1 27.6,66.1 | 73.5,24.26 J4.107 | 71.04,21.5 C1.1 | U4.3 24.35,71.4 C12.1 27.6,66.1
ARD_RX  (via drill 0.4)
  Top 0.4: v33.9,51.3 32.7,52.5 18.5,52.5 16.6,50.6 v16.6,45.7
  Bottom 0.4: R4.2 20.76,41.46 20.8,41.5 v16.6,45.7 | IC1.30 33.41,51.79 v33.9,51.3
ARD_TX  (via drill 0.4)
  Top 0.4: v17.1,25.8 17.1,33.3 v19.2,35.4 | v19.5,38 32.1,38 33.9,36.2 42.1,36.2 43.7,37.8 43.7,52.3 39,57 v36.9,57
  Bottom 0.4: U1.3 18.66,20.14 17.1,21.7 v17.1,25.8 | v19.2,35.4 19.2,37.7 v19.5,38 | IC1.31 34.23,55.23 36,57 v36.9,57
CD  (via drill 0.4)
  Top 0.4: J6.CD1 28.65,15.65 28.4,15.9 28.4,30.2 | 29.9,32.5 44.1,32.5 45.6,34 45.6,53.7 v43.1,56.2
  Top 0.406: 28.4,30.2 28.4,31 29.9,32.5
  Bottom 0.406: IC1.32 35.91,53.8 38.3,56.2 v43.1,56.2
CLK  (via drill 0.4)
  Top 0.4: v29.5,18.4 29.5,30.2 | 30.4,31.4 44.1,31.4 46.4,33.7 46.4,54.3 v45.6,55.1
  Top 0.406: 29.5,30.2 29.5,30.5 30.4,31.4
  Bottom 0.3: 30.8,16.48 U6.9
  Bottom 0.4: U6.3 37.17,12.22 36.2,13.2 31.8,13.2 30.8,14.2 30.8,16.48 | U6.9 30.82,17.98 30.4,18.4 v29.5,18.4
  Bottom 0.406: IC1.2 37.4,51.7 38.7,53 43.5,53 v45.6,55.1
CMP
  Bottom 0.4: R8.1 R9.2 2.52,27.52 U5.3
CS  (via drill 0.4)
  Top 0.4: v26.2,13.9 26.2,32.1 29.1,35 v31,35 | v31,41.6 v34.5,41.6
  Bottom 0.4: U6.7 32.09,11.71 31.3,12.5 27.6,12.5 v26.2,13.9 | 34.2,45.55 IC1.10 34.23,43.27 34.5,43 v34.5,41.6 | v31,35 v31,41.6
CS_TFT  (via drill 0.4)
  Top 0.4: LCD1.12 v6.8,54.2
  Bottom 0.4: v6.8,54.2 8.8,54.2 U7.10
CS_TFT_IN  (via drill 0.4)
  Top 0.4: v9.1,56.7 9.8,57.4 16.6,57.4 17.2,56.8 17.2,53.9 17.8,53.3 33.9,53.3 34.9,52.3 34.9,50.7 33,48.8 29.5,48.8 28.9,48.2 28.9,46.9 29.5,46.3 30.6,46.3 31.4,45.5 v31.4,43.8
  Bottom 0.4: v31.4,43.8 31.81,44.21 IC1.13 | U7.9 9.1,55.55 v9.1,56.7
DC  (via drill 0.4)
  Top 0.4: v4.9,49.6 4.9,57.5 7.4,60 26.1,60 26.8,59.3 v26.8,55.5
  Bottom 0.4: v4.9,49.6 4.45,49.15 2.78,49.15 arc-90 U7.3 | v26.8,55.5 29.8,55.5 30.2,55.1 30.2,53.82 IC1.26
DC_TFT  (via drill 0.4 pad 0.6)
  Top 0.4: LCD1.7 6.5,50.2 5.9,49.6
  Top 0.406: v5.7,47.9 5.9,47.9 5.9,49.6
  Bottom 0.4: v5.7,47.9 5.83,47.92 U7.2
DI  (via drill 0.4)
  Top 0.4: v34.6,12.2 v43.8,12.2
  Bottom 0.4: U6.5 34.63,12.34 v34.6,12.2 | v43.8,12.2 47.4,12.2 48.2,13 48.2,30.9 46.5,32.6 35.5,32.6 33.41,34.69 IC1.11
DO  (via drill 0.4)
  Top 0.4: J6.7 30.49,8.31 27.4,11.4 27.4,30.2
  Top 0.406: 27.4,30.2 27.4,31.7 29.4,33.7 44.2,33.7 44.8,34.3 44.8,53.1 v43.2,54.7
  Bottom 0.406: v43.2,54.7 38.1,54.7 36.4,53 36.4,52.55 IC1.1
GATE_CMD  (via drill 0.4, 0.4 pad 0.8)
  Top 0.4: v21.2,6.2 12.4,6.2 v5.4,13.2
  Bottom 0.4: v5.4,13.2 3.9,14.7 3.9,24.23 U5.1
  Bottom 0.5: T1.3 21.22,6.22 v21.2,6.2
GND  (via drill 0.4, 0.4 pad 0.6, 0.4 pad 0.8)
  Top 0.4: LCD1.13 10.6,55 10.4,55.2 7,55.2 7,57.2 v7.5,57.7 | LCD1.5 8,48.6 | LCD1.2 13.6,46.2 14.2,45.6 14.2,43.3
  Top 0.406: v39,49.5 39,50.8 v39.9,51.7 | v6.9,47.5 8,48.6
  Top 0.5: J3.5 J3.3 | J5.GND 10.45,17.45 11.5,16.4
  Bottom 0.4: 37.18,50.88 37.68,50.88 | 31.3,49.3 30.9,49.3 30.1,50.1 29.5,50.1 | 24.6,55.31 24.61,55.3 25.1,55.3 v25.9,54.5 | C15.1 22.07,10.33 22.7,9.7 C16.2
  Bottom 0.406: IC1.3 37.18,50.88 | v39,49.5 38.78,49.28 IC1.5 36.32,49.3 31.3,49.3 | IC1.21 29.5,50.1 | 37.68,50.88 37.88,50.88 38.8,51.8 39.9,51.8 v39.9,51.7 | v6.9,47.5 6.9,46.1 v8.1,44.9
  Bottom 0.6: 39.2,63.52 C10.2 35.35,63.55 34.5,64.4 | 34.5,64.4 34.5,72.1 | 34.5,72.1 34.5,72.55 U3.3 | C11.2 33.6,63.5 34.5,64.4 | U4.1 25.27,67.18 C13.2 | 33.4,73.2 34.5,72.1 | 32.5,71.7 v33.3,72.5
  other vias: 51.8,14.8 57.5,3.9 81.9,42.8 80.4,55.3 46.2,29.4 68.5,74.7 55.1,47.95 63.4,21.2 92.4,55.4 86.5,74.5 55.7,35.5 54.6,74.5 76.8,68.4 68.2,61.5 87.1,3.8 33.3,74.4 35.8,74.4 35.8,72.5 35.8,70.7 33.3,70.7 4.7,62 5.7,32.6 24.7,64.3 15.2,55.3 4.2,26.5 31.2,30.4 43.4,35.6 23.6,7.5 23.4,20.2 12.7,32.1 25,41 26.3,50.5 24,48.2 19.6,40.7 16.9,42.7 25.5,58.9 36.1,35 29.4,36.7 47.6,49.6 42.9,64.6 38.2,46.6 8.2,39 41.8,18 93.3,15.3 22.5,30.7 5.1,9.5 31.6,61.6 11.6,13.2 58.2,59.25 9,73 80.9,33.9 41.3,37.7 18,59 41.5,10.4
  pour Top (isolate 0.3): 0,3 arc90 3,0 97,0 arc90 100,3 100,77 arc90 97,80 3,80 arc90 0,77
  pour Bottom: 0,3 arc90 3,0 97,0 arc90 100,3 100,4 100,77 arc90 97,80 3,80 arc90 0,77
JOY  (via drill 0.4)
  Top 0.4: U$3.CTR 32.4,22.2 33.5,22.2 | 33.5,22.2 v38.6,22.2 | 33.5,22.2 v34.7,23.4
  Bottom 0.4: R14.2 38.7,19.5 R18.1 38.65,22.15 v38.6,22.2 | v34.7,23.4 34.7,32.3 32.6,34.4 32.6,45.55 IC1.12
LED_K  (via drill 0.4)
  Top 0.406: v19.7,39.2 33,39.2 v35,37.2
  Bottom 0.4: v35,37.2 35.6,37.8 35.6,43.3 35.01,43.89 IC1.9
  Bottom 0.406: T2.1 v19.7,39.2 | 35,45.56 IC1.9
MASTER_RESET  (via drill 0.4)
  Top 0.4: v17.9,38.1 17.9,40.7 20.5,43.3 20.5,49.3 22.9,51.7 31.8,51.7 v32.6,50.9
  Bottom 0.4: C19.1 v17.9,38.1 | 45.2,58.4 49.61,53.99 J7.2 53.4,51.69 53.4,44.7 52.3,43.6 50.75,43.6 R13.2 | v32.6,50.9 32.6,53.78 IC1.29
  Bottom 0.406: IC1.29 32.63,56.23 34.8,58.4 45.2,58.4
MISO  (via drill 0.4)
  Top 0.4: v39.8,39.1 36.2,42.7 v30.1,42.7 30.1,44.1 v28.6,45.6
  Top 0.5: v66.98,39.1 v49.7,39.1 49.7,26.8 57.2,19.3 62.2,19.3 63.36,18.14 J4.118
  Bottom 0.4: v28.6,45.6 29.4,45.6 IC1.16 | v39.8,39.1 v49.7,39.1
  Bottom 0.5: v66.98,39.1 69.19,41.31 J3.16 68.41,51.4 65.2,51.4 63.1,53.5 63.1,60.9 55.2,68.8 45.2,68.8 44,70 J1.1 | J4.118 J4.18
  Bottom 0.6: 69.21,52.2 J3.16
MOSI  (via drill 0.4)
  Top 0.4: v21.4,42.9 v28.8,42.9 28.8,41.3 29.8,40.3 34.5,40.3 v37.6,37.2
  Top 0.5: v58.7,45.4 58.7,50.6 61.08,52.98 J3.15
  Bottom 0.4: 46.5,74.38 J1.4 | v21.4,42.9 14.3,50 10.7,50 9.89,49.2 U7.14 | 52.2,38.9 52.2,35.7 50.9,34.4 40.4,34.4 v37.6,37.2 | v28.8,42.9 30.21,44.31 IC1.15
  Bottom 0.5: J3.15 65.52,52.98 64.3,54.2 64.3,61.9 49.6,76.6 47.5,76.6 46.5,75.6 46.5,74.38 | J4.17 J4.117 60.82,17.08 58.9,19 57.5,19 52.2,24.3 52.2,38.9 v58.7,45.4
MOSI_TFT  (via drill 0.4 pad 0.6)
  Top 0.4: v14.1,48.8 14.1,50.7 13.8,51 LCD1.8
  Bottom 0.4: v14.1,48.8 14.1,48.2 13.78,47.88 8.92,47.88 U7.15
N$1  (via drill 0.4)
  Top 0.3: 45.39,14.2 ACT.A
  Top 0.4: v32.6,14.2 45.39,14.2
  Bottom 0.4: U6.10 32.09,14.71 v32.6,14.2
N$2  (via drill 0.4)
  Top 0.3: J6.5 v32.69,3.61 v32.7,3.6
  Bottom 0.3: 38.4,10.31 U6.2
  Bottom 0.4: v32.7,3.6 37.5,3.6 38.4,4.5 38.4,10.31
N$3  (via drill 0.4)
  Top 0.3: 35.99,8.11 35.99,8.1
  Top 0.4: v33.4,8.6 35.5,8.6 35.99,8.11 | J6.2 35.99,8.1 36.56,8.67 R3.1
  Bottom 0.3: v33.4,8.6 33.4,10.32 U6.6
N$4
  Top 0.3: 45.55,10.43 R3.2
  Top 0.4: ACT.C 45.55,10.43
N$5  (via drill 0.4)
  Top 0.4: J6.3 34.89,6.89 v34.9,7.4
  Bottom 0.3: U6.4
  Bottom 0.4: v34.9,7.4 34.9,8 35.9,9 U6.4
N$6  (via drill 0.4)
  Top 0.4: S2.A2 22.07,10.68 24.9,13.5 24.9,33.1 v27.6,35.8 | v27.6,44.2 27.6,48.6 29.6,50.6 v31.4,50.6
  Bottom 0.4: v27.6,35.8 v27.6,44.2 | v31.4,50.6 30.3,51.7 IC1.23
N$7  (via drill 0.4)
  Top 0.4: S1.A2 23.9,23.66 23.9,34.3 v23.2,35 | v22.6,48.3 v24.8,50.5
  Bottom 0.4: IC1.24 28.09,52.5 26,52.5 24.8,51.3 v24.8,50.5 | v23.2,35 22.6,35.6 v22.6,48.3
N$8
  Top 0.6: R5.2 22.01,13.29 S2.B2
N$9
  Top 0.6: R6.2 21.89,26.27 S1.B2
N$10
  Top 0.4: POWER.C R7.2
N$14
  Bottom 0.4: U1.13 15.37,18.86 16.1,19.6 C19.2
N$15
  Bottom 0.5: 18.88,5.22 F1.1 18.8,5.05 18.8,4.3 18.92,4.18 T1.1
N$17
  Bottom 0.4: U1.2 18.59,21.41 17.9,22.1 17.9,23.5 19,24.6 19,31.2 19.84,32.04 R4.1
N$18  (via drill 0.4)
  Top 0.4: v15.2,45.7 15.2,46.6 14.8,47 LCD1.3
  Bottom 0.4: T2.3 14.2,41.4 15.2,42.4 v15.2,45.7
N$20  (via drill 0.4)
  Top 0.4: U$3.UP 43.09,22.1 v46.1,22.1
  Bottom 0.4: R14.1 46.1,20.55 v46.1,22.1 | 46.1,23.7 arc-90 R15.2
  Bottom 0.406: v46.1,22.1 46.6,22.6 46.6,23.7 R15.2
N$21  (via drill 0.4)
  Top 0.4: v40.5,23.7 42.4,23.7 42.9,24.2 U$3.LEFT
  Top 0.406: v44.9,25.7 42.91,25.7 U$3.LEFT
  Bottom 0.4: R17.1 40.45,23.75 v40.5,23.7
  Bottom 0.406: R15.1 44.95,25.75 v44.9,25.7
N$22  (via drill 0.4)
  Top 0.5: U$3.DOWN 40.42,28.57 v40.4,28.6
  Bottom 0.4: R16.2 R17.2
  Bottom 0.5: v40.4,28.6 R16.2
N$23  (via drill 0.4)
  Top 0.5: v36.8,25.8 32.19,25.8 U$3.RGT
  Bottom 0.5: R16.1 36.75,25.85 v36.8,25.8
OSC3
  Bottom 0.4: C4.1 44.66,45.44 Y1.3 42.24,45.66 41.9,46 41.9,46.9 41.12,47.68 IC1.7
OSC4
  Bottom 0.4: Y1.1 39.28,41.8 C5.1 37.1,46.13 IC1.8
PWRIN
  Bottom 0.6: J2.PWR 15.66,70.06 13.7,68.1 D1.A
RES_TFT  (via drill 0.4)
  Top 0.4: v27.9,54.5 27.9,59.6 26.7,60.8 6.4,60.8 v5.5,59.9
  Bottom 0.4: v5.5,59.9 5.4,59.8 5.4,52.4 4.74,51.73 U7.5 | 29.4,53.83 IC1.25 28.6,53.8 v27.9,54.5
RESET  (via drill 0.4)
  Top 0.4: 88.02,55.38 88.3,55.38 | J1.5 51.08,69.8 52.9,69.8 54.1,68.6 54.1,52.6 52.8,51.3 51.25,51.3 J7.1 51.1,49.2 50,48.1 v48.9,48.1 | v34.6,47.5 35.2,48.1 v42.5,48.1
  Top 0.5: 88.02,55.38 92,51.4 92,31.33 J4.1 | J3.29 88.3,55.38 91.9,58.98 91.9,68.8 88.9,71.8 J1.5
  Bottom 0.4: IC1.14 31.03,46.73 31.8,47.5 v34.6,47.5 | v42.5,48.1 v48.9,48.1
  Bottom 0.6: J4.101 J4.1
RESET_TFT  (via drill 0.4 pad 0.6)
  Top 0.4: v7.1,49.1 7.4,49.4 LCD1.6
  Bottom 0.4: v7.1,49.1 5.74,50.47 U7.4
SCK  (via drill 0.4)
  Top 0.4: 73.83,44.9 J3.17 | v21.5,46.9 25.5,46.9 v26.6,45.8 | 46.54,68.26 45.08,66.8 36.9,66.8 35.7,65.6 35.7,50 33.2,47.5 v30.4,47.5
  Top 0.5: J1.3 46.54,68.26 47.2,67.6 v52.5,67.6 | J3.17 72.55,44.85 69.1,48.3 v67.5,48.3
  Bottom 0.4: v21.5,46.9 18.5,46.9 12.39,53.01 U7.11 8.92,52.95 | v26.6,45.8 26.6,46.6 26.9,46.9 IC1.17 29.8,46.9 v30.4,47.5
  Bottom 0.5: v67.5,48.3 65.4,48.3 61.6,52.1 61.6,60.2 54.2,67.6 v52.5,67.6 | 65.9,17.2 67.6,18.9 87.1,18.9 90.5,22.3 90.5,31.5 85.8,36.2 76.1,36.2 73.88,38.42 J3.17 | J4.119 J4.19
  Bottom 0.6: 65.9,17.2 J4.119
SCK_TFT  (via drill 0.4)
  Top 0.4: LCD1.9 v6.8,51.8
  Bottom 0.4: v6.8,51.8 8.81,51.8 U7.12
SCL  (via drill 0.4)
  Top 0.4: v29.4,56.8 30.5,57.8 v32.5,57.8
  Bottom 0.4: IC1.28 31.8,53.82 31.8,57.1 v32.5,57.8 | v29.4,56.8 29.18,56.59 U2.6 21.09,56.59 20.3,55.8 20.3,51.75 R1.1
SDA
  Bottom 0.4: IC1.27 31,53.83 31,56.9 30.05,57.85 U2.5 22.82,57.9 19.9,57.9 19.2,57.2 19.2,53.2 18.6,52.6 R2.1
USB_D+  (via drill 0.4)
  Top 0.4: J5.D+ 10.65,19.05 12.1,17.6 v18.1,17.6
  Bottom 0.4: v18.1,17.6 U1.5
USB_D-  (via drill 0.4)
  Top 0.4: J5.D- 11.45,19.85 12.7,18.6 v16.7,18.6
  Bottom 0.4: v16.7,18.6 16.7,17.1 17.5,16.3 19.54,16.3 U1.6
USBVCC  (via drill 0.4)
  Top 0.5: J5.VBUS 7.05,20.65 6,19.6 v6,19.1
  Bottom 0.5: F1.2 13.3,4.2 9.8,7.7 9.8,15.3 v6,19.1
VIN  (via drill 0.4)
  Top 0.4: v7.2,67.6 4.2,67.6 1.9,65.3 1.9,36.7 v2.5,36.1
  Bottom 0.4: v2.5,36.1 R8.2 | v7.2,67.6 9,67.6 11,65.6 11,64 12,63 17,63 18.1,64.1 D1.C
  Bottom 0.6: U3.1 C10.1 39.2,65.38 39.2,76.5 38.2,77.5 22.3,77.5 21.3,76.5 21.3,67.3 20.1,66.1 D1.C
XI1
  Bottom 0.4: U1.7 20.64,15.05 20.9,14.8 C16.1
  Bottom 0.5: Y3.1 18.68,8.9 C16.1
XO1
  Bottom 0.4: U1.8 19.57,13.16 19.1,12.7 15.4,12.7 15,12.3 15,11.3 Y3.3
  Bottom 0.5: Y3.3 14.9,11.2 C17.1
XTAL_1
  Bottom 0.5: 69,34.15 69,31.6 68.44,31.04 J4.9 J4.109
  Bottom 0.6: 71.76,34.36 C2.1 72,63.7 73.31,65.01 J3.7 | 69,34.15 Y2.3
  Bottom 0.8: Y2.3 71.76,34.36
XTAL_2  (via drill 0.4)
  Top 0.6: J3.8 73.88,53.48 70.1,49.7 63.6,49.7 v62,48.1
  Bottom 0.5: C3.1 62,33.7 65.9,29.8 J4.10 J4.110
  Bottom 0.6: C3.1 v62,48.1
  Bottom 0.8: Y2.1 65.25,36.6 C3.1

### Text on the board
tPlace: SLAVE | MASTER
tNames: * | TQFP-32 SOCKET | VIN | * | A | B | USB | ZIF-28 SOCKET | MICRO SD
bNames: U3 | U4